# Altium project BtPS-250.PrjPcb
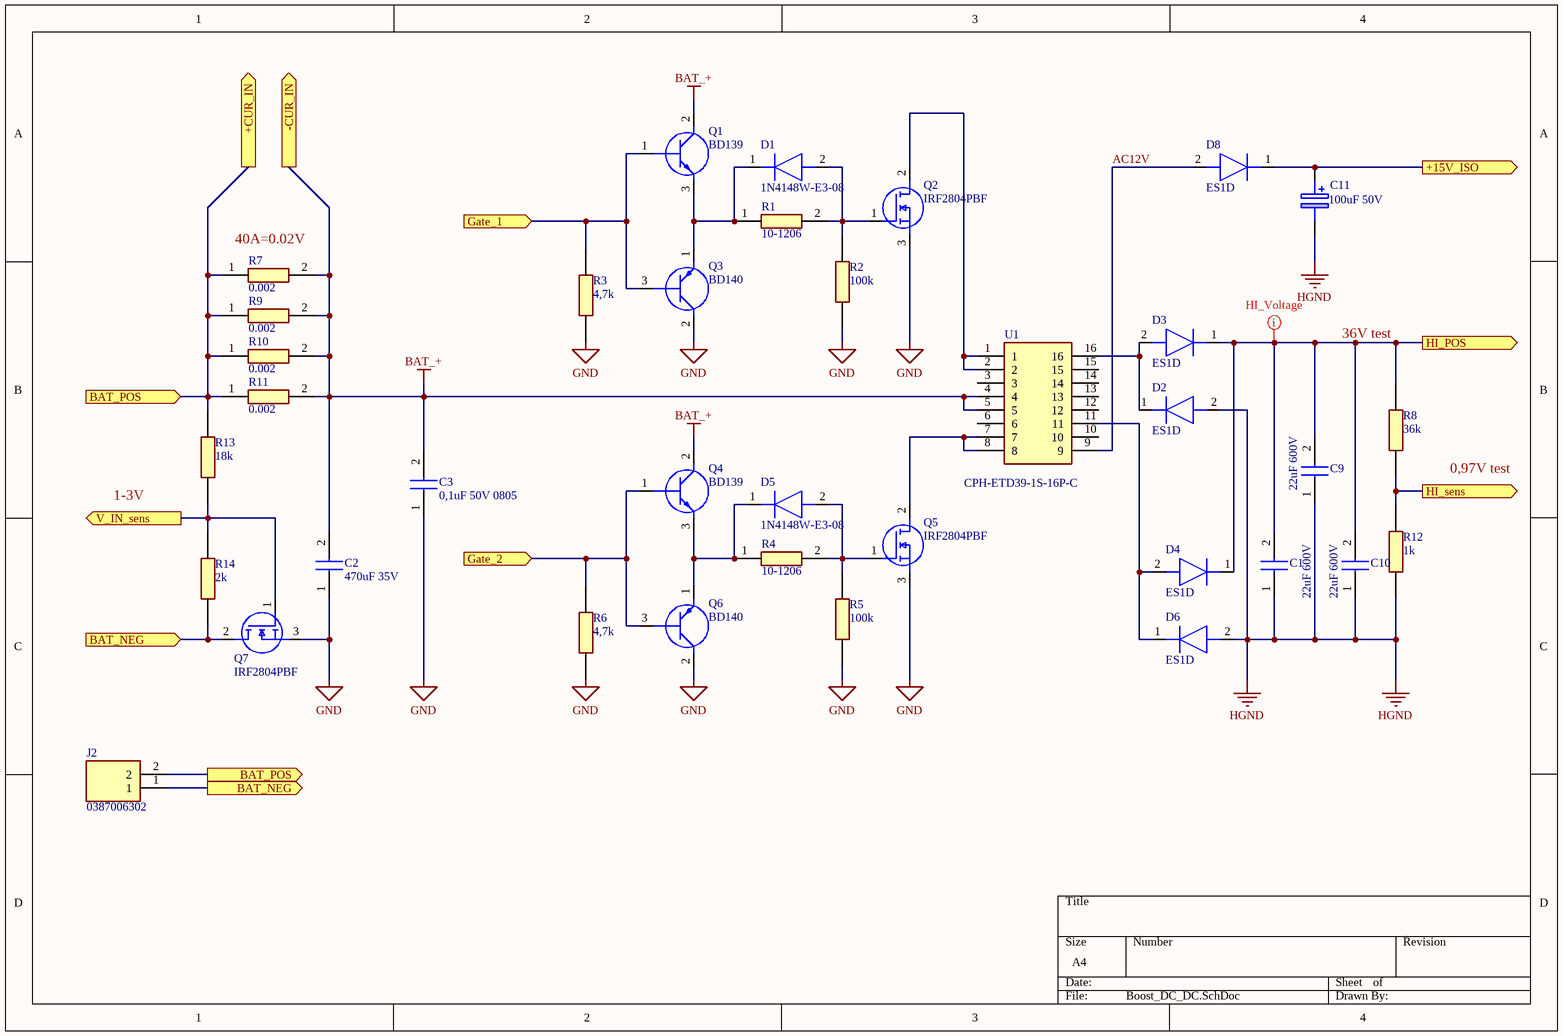
[diagram p0: Boost_DC_DC.SchDoc]
7 sheets, 145 parts. Net scope: flat (ports and power ports of the same name join across sheets).
Board file: BtPS-250.PcbDoc
Sheets:
  Boost_DC_DC.SchDoc
  Boost_Driver.SchDoc
  PWM_inverter.SchDoc
  PWM_Driver.SchDoc
  MCU.SchDoc
  Power_suply.SchDoc
  Mesure.SchDoc

## Sheet Boost_DC_DC.SchDoc
size A4

### Parts
C1  22uF 600V  [CAPPRD750W80D1625H2700]
C2  470uF 35V  [CAPPRD750W80D1625H2700]
C3  0,1uF 50V 0805  [CAPC2012X90N]
C9  22uF 600V  [CAPPRD750W80D1625H2700]
C10  22uF 600V  [CAPPRD750W80D1625H2700]
C11  100uF 50V  [CAPPRD500W60D870H1200]
D1  1N4148W-E3-08  [SOD3716X135N]
D2  ES1D  [DIOM5226X295N]
D3  ES1D  [DIOM5226X295N]
D4  ES1D  [DIOM5226X295N]
D5  1N4148W-E3-08  [SOD3716X135N]
D6  ES1D  [DIOM5226X295N]
D8  ES1D  [DIOM5226X295N]
J2  0387006302  [0387006302]
Q1  BD139  [TO254P290X760X1320-3P]
Q2  IRF2804PBF  [TO254P482X1016X2192-3P]
Q3  BD140  [TO229P300X760X1364-3P]
Q4  BD139  [TO254P290X760X1320-3P]
Q5  IRF2804PBF  [TO254P482X1016X2192-3P]
Q6  BD140  [TO229P300X760X1364-3P]
Q7  IRF2804PBF  [TO254P482X1016X2192-3P]
R1  10-1206  [RESC3116X75N]
R2  100k  [RESC2013X65N]
R3  4,7k  [RESC2013X65N]
R4  10-1206  [RESC3116X75N]
R5  100k  [RESC2013X65N]
R6  4,7k  [RESC2013X65N]
R7  0.002  [RESC3116X75N]
R8  36k  [RESC2013X65N]
R9  0.002  [RESC3116X75N]
R10  0.002  [RESC3116X75N]
R11  0.002  [RESC3116X75N]
R12  1k  [RESC2013X65N]
R13  18k  [RESC2013X65N]
R14  2k  [RESC2013X65N]
U1  CPH-ETD39-1S-16P-C  [DIPS3048W80P508L4460H3610Q16N]

### Ports
+15V_ISO (out), +CUR_IN (out), -CUR_IN (out), BAT_NEG (in), BAT_NEG (out), BAT_POS (in), BAT_POS (out), Gate_1 (in), Gate_2 (in), HI_POS (out), HI_sens (out), V_IN_sens (out)

### Nets
BAT_+: C2.2(-) C3.2 Q1.2(C) Q4.2(C) R7.2 R9.2 R10.2 R11.2 U1.4 U1.5 ; port -CUR_IN
GND: C2.1(+) C3.1 Q2.3(S) Q3.2(C) Q5.3(S) Q6.2(C) Q7.3(S) R2.1 R3.1 R5.1 R6.1
HGND: C1.1(+) C9.1(+) C10.1(+) C11.2(-) D2.2(A) D6.2(A) R12.1
AC12V: D8.2(A) U1.9
NetB4_1: C11.1(+) D8.1(K) ; port +15V_ISO
NetC1_2: C1.2(-) C9.2(-) C10.2(-) D3.1(K) D4.1(K) R8.2 ; port HI_POS
NetD1_1: D1.1(K) Q1.3(E) Q3.1(E) R1.1
NetD1_2: D1.2(A) Q2.1(G) R1.2 R2.2
NetD2_1: D2.1(K) D3.2(A) U1.16
NetD4_2: D4.2(A) D6.1(K) U1.11
NetD5_1: D5.1(K) Q4.3(E) Q6.1(E) R4.1
NetD5_2: D5.2(A) Q5.1(G) R4.2 R5.2
NetIC1_9: Q4.1(B) Q6.3(B) R6.2 ; port Gate_2
NetIC1_10: Q1.1(B) Q3.3(B) R3.2 ; port Gate_1
NetIC2_3: J2.2 R7.1 R9.1 R10.1 R11.1 R13.2 ; port BAT_POS, port +CUR_IN
NetJ2_1: J2.1 Q7.2(D) R14.1 ; port BAT_NEG
NetQ2_2: Q2.2(D) U1.1 U1.2
NetQ5_2: Q5.2(D) U1.7 U1.8
NetQ7_1: Q7.1(G) R13.1 R14.2 ; port V_IN_sens
NetR8_1: R8.1 R12.2 ; port HI_sens

Not connected (* = marked no-connect by the designer): U1 3 6 10 12 13 14 15

### Layout directives
net class HI_Voltage: NetC1_2

### Notes on the sheet
- (near R7) 40A=0.02V
- 36V test
- 1-3V
- 0,97V test

### Library data of the parts
C1 C2 C9 C10 = UPW1H102MHD: Capacitor; Height: 27mm
C3 = MCMT21N470F250CT: Capacitor; Height: 0.9mm
C11 = MAL203690109E3: Aluminum Electrolytic Capacitors - Radial Leaded 100uF 50V 20% Radial; Manufacturer_Name: Vishay; Geometry.Height: 12mm; Datasheet Link: https://www.vishay.com/docs/28312/036rsp.pdf; Manufacturer_Part_Number: MAL203690109E3; Mouser Part Number: 594-2222-036-90109; Mouser Price/Stock: https://www.mouser.co.uk/ProductDetail/Vishay-BC-Components/MAL203690109E3?qs=4T%252B5yYZyZYdFWMOgqUZuiA%3D%3D; Arrow Part Number: MAL203690109E3; Arrow Price/Stock: https://www.arrow.com/en/products/mal203690109e3/vishay; Mouser Testing Part Number: *; Mouser Testing Price/Stock: *
D1 D5 = 1N4148W-E3-08: Diode; Manufacturer_Name: Vishay; Datasheet Link: http://www.vishay.com/docs/85748/1n4148w.pdf; Height: 1.35mm; Manufacturer_Part_Number: 1N4148W-E3-08; Mouser Part Number: 78-1N4148W-E3-08; Mouser Price/Stock: https://www.mouser.co.uk/ProductDetail/Vishay-Semiconductors/1N4148W-E3-08?qs=bTzheeSci6TVjpxfjjRVMw%3D%3D; Arrow Part Number: 1N4148W-E3-08; Arrow Price/Stock: https://www.arrow.com/en/products/1n4148w-e3-08/vishay?region=nac
D2-D4 D6 D8 = ES1D: Diode; Manufacturer_Name: SMC; Datasheet Link: https://4donline.ihs.com/images/VipMasterIC/IC/SMCD/SMCD-S-A0005425901/SMCD-S-A0005425901-1.pdf?hkey=833C7E3902CC3CD9C0453977398360A8; Height: 2.95mm; Manufacturer_Part_Number: ES1D
J2 = 0387006302: Connector; Manufacturer_Name: Molex; Datasheet Link: https://datasheet.datasheetarchive.com/originals/distributors/Datasheets-DGA23/1543392.pdf; Height: 13mm; Manufacturer_Part_Number: 0387006302; Mouser Part Number: N/A; Mouser Price/Stock: https://www.mouser.co.uk/ProductDetail/Molex/0387006302/?qs=PBcRNPEHKsoO9p6NPCT14g%3D%3D; Arrow Part Number: 0387006302; Arrow Price/Stock: https://www.arrow.com/en/products/0387006302/molex
Q1 Q4 = BD139: Transistor BJT NPN; Manufacturer_Name: STMicroelectronics; Datasheet Link: http://www.st.com/web/en/resource/technical/document/datasheet/CD00001225.pdf; Height: 2.9mm; Manufacturer_Part_Number: BD139; Mouser Part Number: 511-BD139; Mouser Price/Stock: https://www.mouser.co.uk/ProductDetail/STMicroelectronics/BD139?qs=ljbEvF4DwOPW%2FLxHSWYMMA%3D%3D; Arrow Part Number: BD139; Arrow Price/Stock: https://www.arrow.com/en/products/bd139/stmicroelectronics?region=europe
Q2 Q5 Q7 = IRF2804PBF: MOSFET (N-Channel); Manufacturer_Name: Infineon; Datasheet Link: https://componentsearchengine.com/Datasheets/1/IRF2804PBF.pdf; Height: 4.82mm; Manufacturer_Part_Number: IRF2804PBF; Mouser Part Number: 942-IRF2804PBF; Mouser Price/Stock: https://www.mouser.co.uk/ProductDetail/Infineon-IR/IRF2804PBF?qs=2r01AXMCG3OqtrI77lWLsA%3D%3D; Arrow Part Number: IRF2804PBF; Arrow Price/Stock: https://www.arrow.com/en/products/irf2804pbf/infineon-technologies-ag
Q3 Q6 = BD138: Transistor BJT PNP; Manufacturer_Name: onsemi; Datasheet Link: http://www.onsemi.com/pub/Collateral/BD136-D.PDF; Height: 3mm; Manufacturer_Part_Number: BD138; Mouser Part Number: 863-BD138; Mouser Price/Stock: https://www.mouser.co.uk/ProductDetail/onsemi/BD138?qs=vNc2DXHODiJSpBHA4I4SSg%3D%3D
R1 R4 R7 R9-R11 = MCMR12X1003FTL: Resistor; Height: 0.75mm
R2 R3 R5 R6 R8 R12-R14 = ERJP06J822V: Resistor; Height: 0.7mm
U1 = CPH-ETD39-1S-16P-C: Undefined or Miscellaneous; Manufacturer_Name: FERROXCUBE; Datasheet Link: http://www.farnell.com/datasheets/1935353.pdf; Height: 36.1mm; Manufacturer_Part_Number: CPH-ETD39-1S-16P-C

## Sheet Boost_Driver.SchDoc
size A4
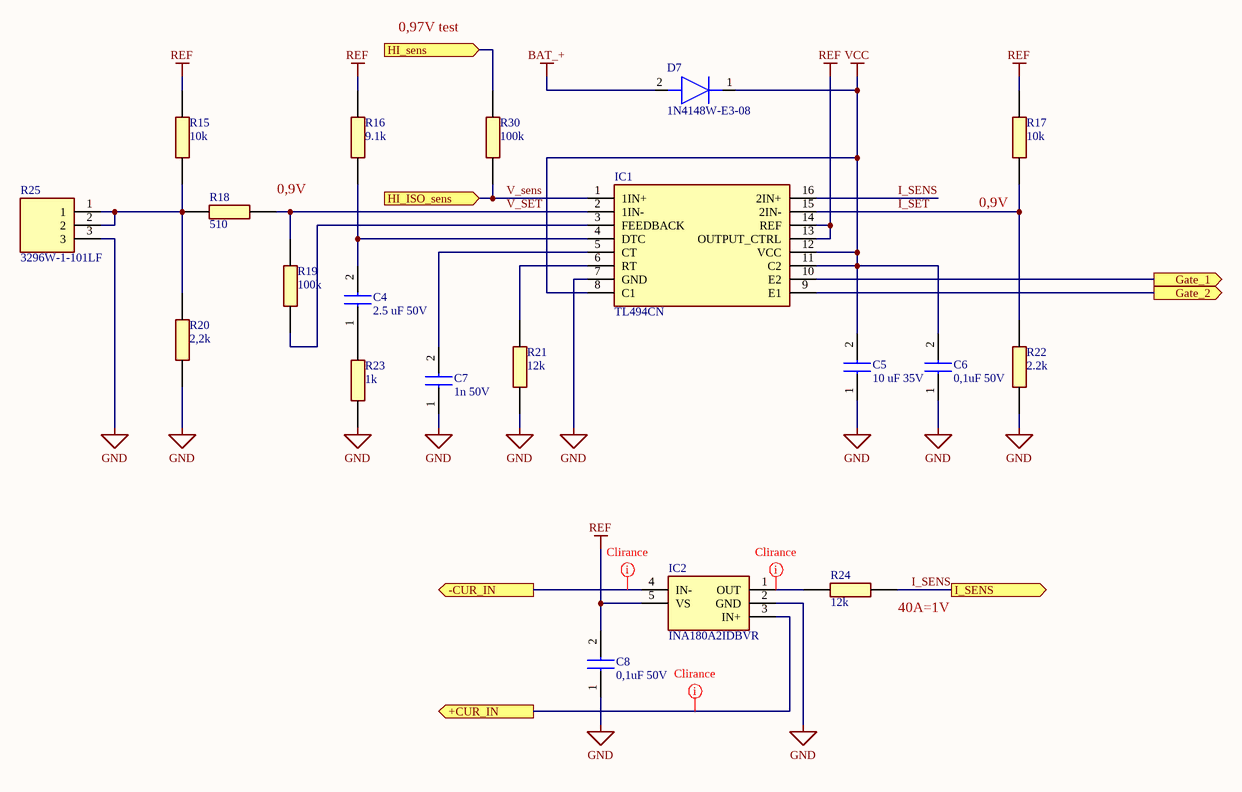
[diagram p1: Boost_Driver.SchDoc]

### Parts
C4  2.5 uF 50V  [CAPC2012X90N]
C5  10 uF 35V  [CAPC2012X90N]
C6  0,1uF 50V  [CAPC2012X90N]
C7  1n 50V  [CAPC2012X90N]
C8  0,1uF 50V  [CAPC2012X90N]
D7  1N4148W-E3-08  [SOD3716X135N]
IC1  TL494CN  [DIP794W53P254L1930H508Q16N]
IC2  INA180A2IDBVR  [SOT95P280X145-5N]
R15  10k  [RESC2013X65N]
R16  9.1k  [RESC2013X65N]
R17  10k  [RESC2013X65N]
R18  510  [RESC2013X65N]
R19  100k  [RESC2013X65N]
R20  2,2k  [RESC2013X65N]
R21  12k  [RESC2013X65N]
R22  2.2k  [RESC2013X65N]
R23  1k  [RESC2013X65N]
R24  12k  [RESC2013X65N]
R25  3296W-1-101LF  [3296W-1]
R30  100k  [RESC2013X65N]

### Ports
+CUR_IN (out), -CUR_IN (out), Gate_1 (out), Gate_2 (out), HI_ISO_sens (in), HI_sens (in), I_SENS (out)

### Nets
BAT_+: D7.2(A) IC2.4(IN-) ; port -CUR_IN
GND: C5.1 C6.1 C7.1 C8.1 IC1.7(GND) IC2.2(GND) R20.1 R21.1 R22.1 R23.1 R25.3
REF: C8.2 IC1.13(OUTPUT_CTRL) IC1.14(REF) IC2.5(VS) R15.2 R16.2 R17.2
VCC: C5.2 C6.2 D7.1(K) IC1.8(C1) IC1.11(C2) IC1.12(VCC)
I_SENS: IC1.16(2IN+) R24.1 ; port I_SENS
I_SET: IC1.15(2IN-) R17.1 R22.2
V_sens: IC1.1(1IN+) R30.2 ; port HI_ISO_sens
V_SET: IC1.2(1IN-) R18.1 R19.1
NetC4_1: C4.1 R23.2
NetC4_2: C4.2 IC1.4(DTC) R16.1
NetC7_2: C7.2 IC1.5(CT)
NetIC1_3: IC1.3(FEEDBACK) R19.2
NetIC1_6: IC1.6(RT) R21.2
NetIC1_9: IC1.9(E1) ; port Gate_2
NetIC1_10: IC1.10(E2) ; port Gate_1
NetIC2_1: IC2.1(OUT) R24.2
NetIC2_3: IC2.3(IN+) ; port +CUR_IN
NetR8_1: R30.1 ; port HI_sens
NetR15_1: R15.1 R18.2 R20.2 R25.1 R25.2

### Layout directives
net class LOW_Clirance: BAT_+, NetIC2_1, NetIC2_3

### Notes on the sheet
- 0,97V test
- (near R18) 0,9V
- (near R17) 0,9V
- (near R24) 40A=1V

### Library data of the parts
C4-C8 = MCMT21N470F250CT: Capacitor; Height: 0.9mm
D7 = 1N4148W-E3-08: Diode; Manufacturer_Name: Vishay; Datasheet Link: http://www.vishay.com/docs/85748/1n4148w.pdf; Height: 1.35mm; Manufacturer_Part_Number: 1N4148W-E3-08; Mouser Part Number: 78-1N4148W-E3-08; Mouser Price/Stock: https://www.mouser.co.uk/ProductDetail/Vishay-Semiconductors/1N4148W-E3-08?qs=bTzheeSci6TVjpxfjjRVMw%3D%3D; Arrow Part Number: 1N4148W-E3-08; Arrow Price/Stock: https://www.arrow.com/en/products/1n4148w-e3-08/vishay?region=nac
IC1 = TL494CN: Integrated Circuit; Manufacturer_Name: Texas Instruments; Datasheet Link: http://www.ti.com/lit/gpn/tl494; Height: 5.08mm; Manufacturer_Part_Number: TL494CN; Mouser Part Number: 595-TL494CN; Mouser Price/Stock: https://www.mouser.co.uk/ProductDetail/Texas-Instruments/TL494CN?qs=N6WZOzgtpqWAYQVxthNGyw%3D%3D; Arrow Part Number: TL494CN; Arrow Price/Stock: https://www.arrow.com/en/products/tl494cn/texas-instruments?region=nac
IC2 = INA180A2IDBVR: Integrated Circuit; Manufacturer_Name: Texas Instruments; Datasheet Link: http://www.ti.com/lit/ds/symlink/ina180.pdf; Height: 1.45mm; Manufacturer_Part_Number: INA180A2IDBVR; Mouser Part Number: 595-INA180A2IDBVR; Mouser Price/Stock: https://www.mouser.co.uk/ProductDetail/Texas-Instruments/INA180A2IDBVR?qs=5aG0NVq1C4wYcJfa99BoHg%3D%3D; Arrow Part Number: INA180A2IDBVR; Arrow Price/Stock: https://www.arrow.com/en/products/ina180a2idbvr/texas-instruments?region=nac
R15-R24 R30 = ERJP06J822V: Resistor; Height: 0.7mm
R25 = 3296W-1-101LF: Resistor; Manufacturer_Name: Bourns; Datasheet Link: https://www.bourns.com/pdfs/3296.pdf; Manufacturer_Part_Number: 3296W-1-101LF; Mouser Part Number: 652-3296W-1-101LF; Mouser Price/Stock: https://www.mouser.co.uk/ProductDetail/Bourns/3296W-1-101LF?qs=UcU9LKO1dwEefwKxVJG4Jw%3D%3D; Arrow Part Number: 3296W-1-101LF; Arrow Price/Stock: https://www.arrow.com/en/products/3296w-1-101lf/bourns?region=europe

## Sheet PWM_inverter.SchDoc
size A4
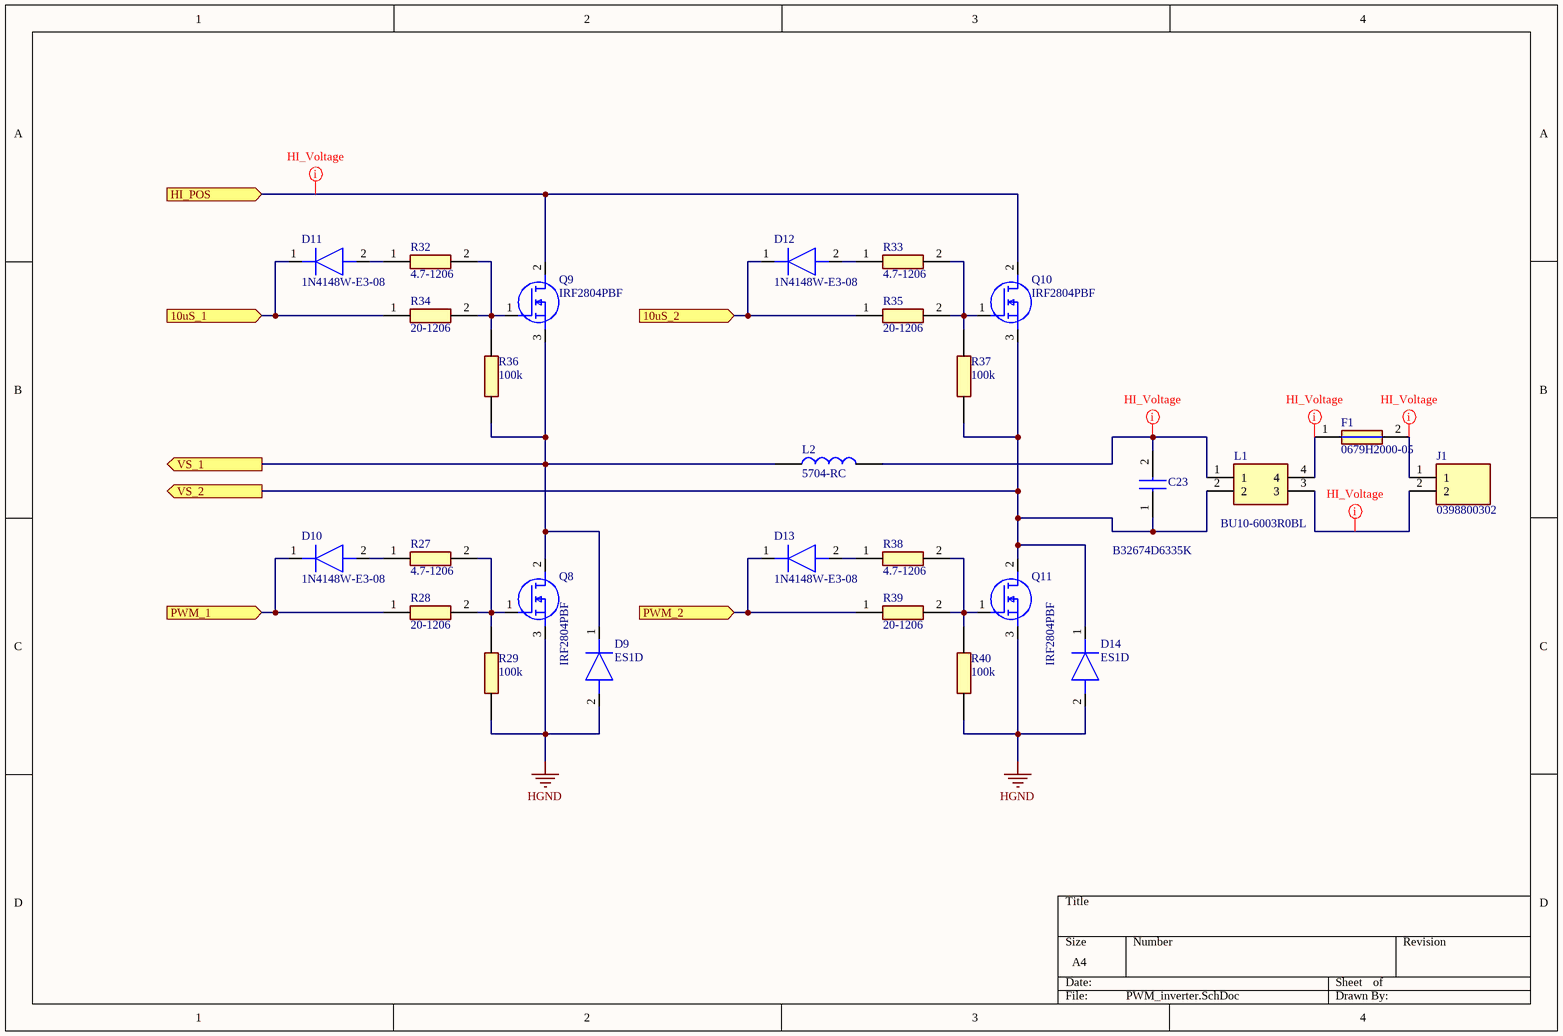
[diagram p2: PWM_inverter.SchDoc]

### Parts
C23  B32674D6335K  [B32674D6335K]
D9  ES1D  [DIOM5226X295N]
D10  1N4148W-E3-08  [SOD3716X135N]
D11  1N4148W-E3-08  [SOD3716X135N]
D12  1N4148W-E3-08  [SOD3716X135N]
D13  1N4148W-E3-08  [SOD3716X135N]
D14  ES1D  [DIOM5226X295N]
F1  0679H2000-05  [FUSC6125X279N]
J1  0398800302  [0398800302]
L1  BU10-6003R0BL  [BU106003R0BL]
L2  5704-RC  [5704RC]
Q8  IRF2804PBF  [TO254P482X1016X2192-3P]
Q9  IRF2804PBF  [TO254P482X1016X2192-3P]
Q10  IRF2804PBF  [TO254P482X1016X2192-3P]
Q11  IRF2804PBF  [TO254P482X1016X2192-3P]
R27  4.7-1206  [RESC3116X75N]
R28  20-1206  [RESC3116X75N]
R29  100k  [RESC2013X65N]
R32  4.7-1206  [RESC3116X75N]
R33  4.7-1206  [RESC3116X75N]
R34  20-1206  [RESC3116X75N]
R35  20-1206  [RESC3116X75N]
R36  100k  [RESC2013X65N]
R37  100k  [RESC2013X65N]
R38  4.7-1206  [RESC3116X75N]
R39  20-1206  [RESC3116X75N]
R40  100k  [RESC2013X65N]

### Ports
10uS_1 (in), 10uS_2 (in), HI_POS (in), PWM_1 (in), PWM_2 (in), VS_1 (out), VS_2 (out)

### Nets
HGND: D9.2(A) D14.2(A) Q8.3(S) Q11.3(S) R29.1 R40.1
NetC1_2: Q9.2(D) Q10.2(D) ; port HI_POS
NetC12_1: D9.1(K) L2.1 Q8.2(D) Q9.3(S) R36.1 ; port VS_1
NetC23_1: C23.1 D14.1(K) L1.2 Q10.3(S) Q11.2(D) R37.1 ; port VS_2
NetC23_2: C23.2 L1.1 L2.2
NetD10_1: D10.1(K) R28.1 ; port PWM_1
NetD10_2: D10.2(A) R27.1
NetD11_1: D11.1(K) R34.1 ; port 10uS_1
NetD11_2: D11.2(A) R32.1
NetD12_1: D12.1(K) R35.1 ; port 10uS_2
NetD12_2: D12.2(A) R33.1
NetD13_1: D13.1(K) R39.1 ; port PWM_2
NetD13_2: D13.2(A) R38.1
NetF1_1: F1.1 L1.4
NetF1_2: F1.2 J1.1
NetJ1_2: J1.2 L1.3
NetQ8_1: Q8.1(G) R27.2 R28.2 R29.2
NetQ9_1: Q9.1(G) R32.2 R34.2 R36.2
NetQ10_1: Q10.1(G) R33.2 R35.2 R37.2
NetQ11_1: Q11.1(G) R38.2 R39.2 R40.2

### Layout directives
net class HI_Voltage: NetC1_2, NetC23_2, NetF1_1, NetF1_2, NetJ1_2

### Library data of the parts
C23 = B32674D6335K: Capacitor; Manufacturer_Name: TDK; Datasheet Link: https://en.tdk.eu/inf/20/20/db/fc_2009/MKP_B32674_678.pdf; Height: 32mm; Manufacturer_Part_Number: B32674D6335K; Mouser Part Number: 871-B32674D6335K; Mouser Price/Stock: https://www.mouser.co.uk/ProductDetail/EPCOS-TDK/B32674D6335K?qs=IQR8xM2KsGjr5uKRT4Ngjw%3D%3D; Arrow Part Number: B32674D6335K; Arrow Price/Stock: https://www.arrow.com/en/products/b32674d6335k/epcos-tdk
D9 D14 = ES1D: Diode; Manufacturer_Name: SMC; Datasheet Link: https://4donline.ihs.com/images/VipMasterIC/IC/SMCD/SMCD-S-A0005425901/SMCD-S-A0005425901-1.pdf?hkey=833C7E3902CC3CD9C0453977398360A8; Height: 2.95mm; Manufacturer_Part_Number: ES1D
D10-D13 = 1N4148W-E3-08: Diode; Manufacturer_Name: Vishay; Datasheet Link: http://www.vishay.com/docs/85748/1n4148w.pdf; Height: 1.35mm; Manufacturer_Part_Number: 1N4148W-E3-08; Mouser Part Number: 78-1N4148W-E3-08; Mouser Price/Stock: https://www.mouser.co.uk/ProductDetail/Vishay-Semiconductors/1N4148W-E3-08?qs=bTzheeSci6TVjpxfjjRVMw%3D%3D; Arrow Part Number: 1N4148W-E3-08; Arrow Price/Stock: https://www.arrow.com/en/products/1n4148w-e3-08/vishay?region=nac
F1 = 0679H2000-05: Fuse; Manufacturer_Name: Bel Circuit Protection; Datasheet Link: https://www.arrow.com/en/products/0679h2000-05/bel-group; Height: 2.79mm; Manufacturer_Part_Number: 0679H2000-05; Arrow Part Number: 0679H2000-05; Arrow Price/Stock: https://www.arrow.com/en/products/0679h2000-05/bel-group?region=nac
J1 = 0398800302: Connector; Manufacturer_Name: Molex; Datasheet Link: https://www.molex.com/pdm_docs/sd/398800302_sd.pdf; Height: 10.3mm; Manufacturer_Part_Number: 0398800302; Mouser Part Number: N/A; Mouser Price/Stock: https://www.mouser.co.uk/ProductDetail/Molex/0398800302?qs=PBcRNPEHKsqSgs7Dx0mONg%3D%3D; Arrow Part Number: 0398800302; Arrow Price/Stock: https://www.arrow.com/en/products/0398800302/molex?region=nac
L1 = BU10-6003R0BL: Inductor; Manufacturer_Name: COILCRAFT; Datasheet Link: https://componentsearchengine.com/Datasheets/1/BU10-6003R0BL.pdf; Height: 22.5mm; Manufacturer_Part_Number: BU10-6003R0BL; Mouser Part Number: 994-BU10-6003R0BL; Mouser Price/Stock: https://www.mouser.co.uk/ProductDetail/Coilcraft/BU10-6003R0BL?qs=ZYnrCdKdyec0p%252B8vTszPQw%3D%3D
L2 = 5704-RC: Inductor High Current Toroid 275uH/150uH 15% 1KHz 2A 0.24Ohm DCR RDL; Manufacturer_Name: Bourns; Geometry.Height: 22.225mm; Manufacturer_Part_Number: 5704-RC; Mouser Part Number: 542-5704-RC; Mouser Price/Stock: https://www.mouser.co.uk/ProductDetail/JW-Miller/5704-RC?qs=bN78%2FnoHSDjVEliEAq9T7g%3D%3D; Arrow Part Number: *; Arrow Price/Stock: *; Mouser Testing Part Number: *; Mouser Testing Price/Stock: *; Datasheet Link: https://www.bourns.com/docs/Product-Datasheets/5700_series.pdf
Q8-Q11 = IRF2804PBF: as Q2 on sheet Boost_DC_DC; Datasheet Link: https://componentsearchengine.com/Datasheets/1/IRF2804PBF.pdf; Height: 4.82mm; Manufacturer_Part_Number: IRF2804PBF; Mouser Part Number: 942-IRF2804PBF; Mouser Price/Stock: https://www.mouser.co.uk/ProductDetail/Infineon-IR/IRF2804PBF?qs=2r01AXMCG3OqtrI77lWLsA%3D%3D; Arrow Part Number: IRF2804PBF; Arrow Price/Stock: https://www.arrow.com/en/products/irf2804pbf/infineon-technologies-ag
R27 R28 R32-R35 R38 R39 = MCMR12X1003FTL: Resistor; Height: 0.75mm
R29 R36 R37 R40 = ERJP06J822V: Resistor; Height: 0.7mm

## Sheet PWM_Driver.SchDoc
size A4
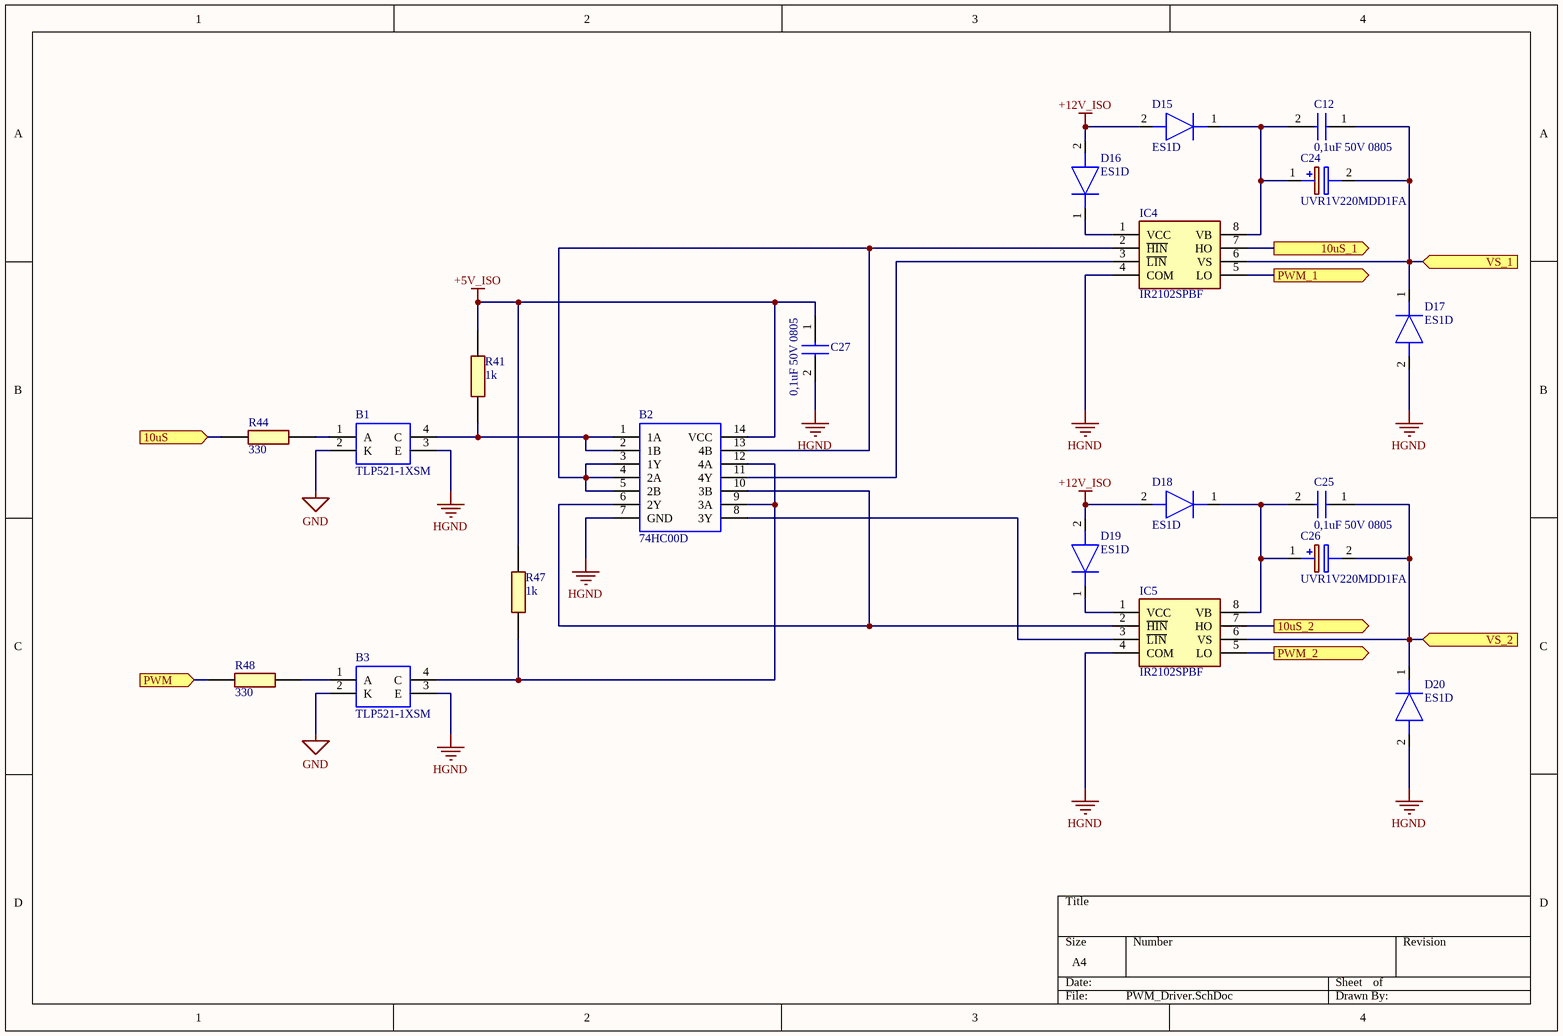
[diagram p3: PWM_Driver.SchDoc]

### Parts
B1  TLP521-1XSM  [SOP254P1016X460-4N]
B2  74HC00D  [SOIC127P600X175-14N]
B3  TLP521-1XSM  [SOP254P1016X460-4N]
C12  0,1uF 50V 0805  [CAPC2012X90N]
C24  UVR1V220MDD1FA  [CAPPRD200W50D525H1250]
C25  0,1uF 50V 0805  [CAPC2012X90N]
C26  UVR1V220MDD1FA  [CAPPRD200W50D525H1250]
C27  0,1uF 50V 0805  [CAPC2012X90N]
D15  ES1D  [DIOM5226X295N]
D16  ES1D  [DIOM5226X295N]
D17  ES1D  [DIOM5226X295N]
D18  ES1D  [DIOM5226X295N]
D19  ES1D  [DIOM5226X295N]
D20  ES1D  [DIOM5226X295N]
IC4  IR2102SPBF  [SOIC127P600X175-8N]
IC5  IR2102SPBF  [SOIC127P600X175-8N]
R41  1k  [RESC2013X65N]
R44  330  [RESC2013X65N]
R47  1k  [RESC2013X65N]
R48  330  [RESC2013X65N]

### Ports
10uS (in), 10uS_1 (out), 10uS_2 (out), PWM (in), PWM_1 (out), PWM_2 (out), VS_1 (in), VS_2 (in)

### Nets
+5V_ISO: B2.14(VCC) C27.1 R41.1 R47.1
+12V_ISO: D15.2(A) D16.2(A) D18.2(A) D19.2(A)
GND: B1.2(K) B3.2(K)
HGND: B1.3(E) B2.7(GND) B3.3(E) C27.2 D17.2(A) D20.2(A) IC4.4(COM) IC5.4(COM)
NetB1_1: B1.1(A) R44.2
NetB1_4: B1.4(C) B2.1(1A) B2.2(1B) R41.2
NetB2_3: B2.3(1Y) B2.4(2A) B2.5(2B) B2.13(4B) IC4.2(~{HIN})
NetB2_6: B2.6(2Y) B2.10(3B) IC5.2(~{HIN})
NetB2_8: B2.8(3Y) IC5.3(~{LIN})
NetB2_9: B2.9(3A) B2.12(4A) B3.4(C) R47.2
NetB2_11: B2.11(4Y) IC4.3(~{LIN})
NetB3_1: B3.1(A) R48.2
NetC12_1: C12.1 C24.2(-) D17.1(K) IC4.6(VS) ; port VS_1
NetC12_2: C12.2 C24.1(+) D15.1(K) IC4.8(VB)
NetC23_1: C25.1 C26.2(-) D20.1(K) IC5.6(VS) ; port VS_2
NetC25_2: C25.2 C26.1(+) D18.1(K) IC5.8(VB)
NetD10_1: IC4.5(LO) ; port PWM_1
NetD11_1: IC4.7(HO) ; port 10uS_1
NetD12_1: IC5.7(HO) ; port 10uS_2
NetD13_1: IC5.5(LO) ; port PWM_2
NetD16_1: D16.1(K) IC4.1(VCC)
NetD19_1: D19.1(K) IC5.1(VCC)
NetR44_1: R44.1 ; port 10uS
NetR48_1: R48.1 ; port PWM

### Library data of the parts
B1 B3 = TLP521-1XSM: Optocoupler; SMD; Channels:1; Out: transistor; Uinsul:5.3kV; Manufacturer_Name: Isocom; Geometry.Height: 4.6mm; Manufacturer_Part_Number: TLP521-1XSM; Mouser Part Number: *; Mouser Price/Stock: *; Arrow Part Number: *; Arrow Price/Stock: *; Mouser Testing Part Number: *; Mouser Testing Price/Stock: *; Datasheet Link: https://datasheet.lcsc.com/szlcsc/Isocom-Components-TLP521-1XSM_C83157.pdf
B2 = 74HC00D: NEXPERIA - 74HC00D - NAND Gate, 74HC00, 2 Input, 5.2 mA, 2 V to 6 V, SOIC-14; Geometry.Height: 1.75mm; Manufacturer_Name: Nexperia; Manufacturer_Part_Number: 74HC00D; Mouser Part Number: 771-74HC00D; Mouser Price/Stock: https://www.mouser.co.uk/ProductDetail/Nexperia/74HC00D?qs=Q7xBXtx7xQgKEyQZmXe6mg%3D%3D; Arrow Part Number: *; Arrow Price/Stock: *; Mouser Testing Part Number: *; Mouser Testing Price/Stock: *; Datasheet Link: https://altium.componentsearchengine.com/Datasheets/2/74HC00D.pdf
C12 C25 C27 = MCMT21N470F250CT: Capacitor; Height: 0.9mm
C24 C26 = UVR1V220MDD1FA: Capacitor Polarised; Manufacturer_Name: Nichicon; Datasheet Link: https://componentsearchengine.com/Datasheets/1/UVR1V220MDD1FA.pdf; Height: 12.5mm; Manufacturer_Part_Number: UVR1V220MDD1FA; Mouser Part Number: 647-UVR1V220MDD1FA; Mouser Price/Stock: https://www.mouser.co.uk/ProductDetail/Nichicon/UVR1V220MDD1FA/?qs=aEaV1LakhLZp9mEQuSYOqQ%3D%3D
D15-D20 = ES1D: Diode; Manufacturer_Name: SMC; Datasheet Link: https://4donline.ihs.com/images/VipMasterIC/IC/SMCD/SMCD-S-A0005425901/SMCD-S-A0005425901-1.pdf?hkey=833C7E3902CC3CD9C0453977398360A8; Height: 2.95mm; Manufacturer_Part_Number: ES1D
IC4 IC5 = IR2102SPBF: Integrated Circuit; Manufacturer_Name: Infineon; Datasheet Link: https://www.infineon.com/cms/en/product/power/gate-driver-ics/?; Height: 1.75mm; Manufacturer_Part_Number: IR2102SPBF; Mouser Part Number: 942-IR2102SPBF; Mouser Price/Stock: https://www.mouser.co.uk/ProductDetail/Infineon-IR/IR2102SPBF?qs=dQmlx5f5cRJqfCRMLAcrGg%3D%3D; Arrow Part Number: IR2102SPBF; Arrow Price/Stock: https://www.arrow.com/en/products/ir2102spbf/infineon-technologies-ag?region=nac
R41 R44 R47 R48 = ERJP06J822V: Resistor; Height: 0.7mm

## Sheet MCU.SchDoc
size A4
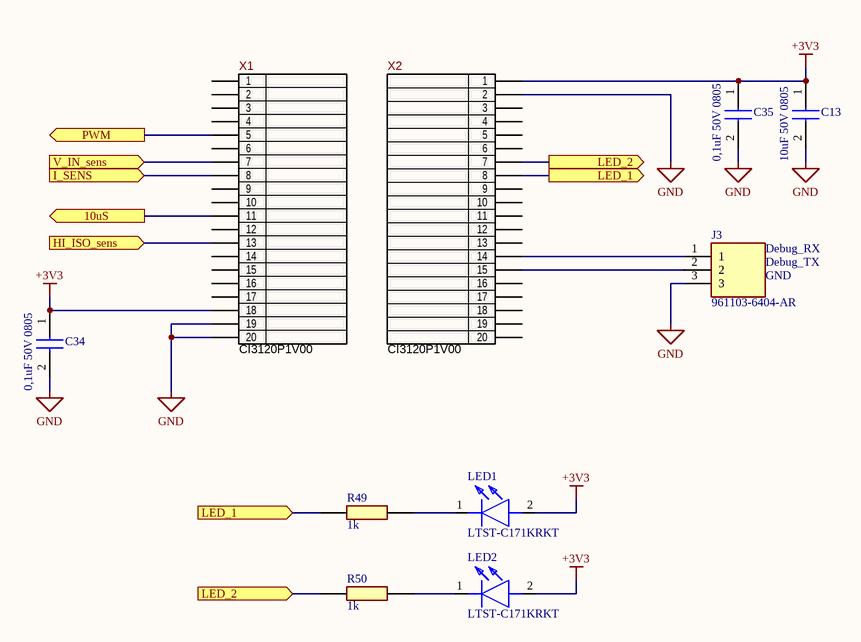
[diagram p4: MCU.SchDoc]

### Parts
C13  10uF 50V 0805  [CAPC2012X90N]
C34  0,1uF 50V 0805  [CAPC2012X90N]
C35  0,1uF 50V 0805  [CAPC2012X90N]
J3  961103-6404-AR  [HDRV3W64P0X254_1X3_762X250X1050P]
LED1  LTST-C171KRKT  [LEDM2012X90N]
LED2  LTST-C171KRKT  [LEDM2012X90N]
R49  1k  [RESC2013X65N]
R50  1k  [RESC2013X65N]
X1  Part Number: CI3120P1V00  [WF-20S]  (hidden comment: WH-20S)
X2  Part Number: CI3120P1V00  [WF-20S]  (hidden comment: WH-20S)

### Ports
10uS (out), HI_ISO_sens (in), I_SENS (in), LED_1 (in), LED_1 (out), LED_2 (in), LED_2 (out), PWM (out), V_IN_sens (in)

### Nets
+3V3: C13.1 C34.1 C35.1 LED1.2(A) LED2.2(A) X1.18 X2.1
GND: C13.2 C34.2 C35.2 J3.3 X1.19 X1.20 X2.2
I_SENS: X1.8 ; port I_SENS
V_sens: X1.13 ; port HI_ISO_sens
NetJ3_1: J3.1 X2.14
NetJ3_2: J3.2 X2.15
NetLED1_1: LED1.1(K) R49.1
NetLED2_1: LED2.1(K) R50.1
NetQ7_1: X1.7 ; port V_IN_sens
NetR44_1: X1.11 ; port 10uS
NetR48_1: X1.5 ; port PWM
NetR49_2: R49.2 X2.8 ; port LED_1
NetR50_2: R50.2 X2.7 ; port LED_2

Not connected (* = marked no-connect by the designer): X1 1 2 3 4 6 9 10 12 14 15 16 17; X2 3 4 5 6 9 10 11 12 13 16 17 18 19 20

### Notes on the sheet
- Debug_TX
- Debug_RX
- GND

### Library data of the parts
C13 C34 C35 = MCMT21N470F250CT: Capacitor; Height: 0.9mm
J3 = 961103-6404-AR: Connector; Manufacturer_Name: 3M; Datasheet Link: https://datasheet.datasheetarchive.com/originals/distributors/Datasheets-DGA21/2082015.pdf; Height: 10.5mm; Manufacturer_Part_Number: 961103-6404-AR; Mouser Part Number: 517-9611036404AR; Mouser Price/Stock: https://www.mouser.co.uk/ProductDetail/3M-Electronic-Solutions-Division/961103-6404-AR?qs=A%252BtsDZJT%252Bi8c%252BGQWaXFlLA%3D%3D
LED1 LED2 = LTST-C171KRKT: LED; Manufacturer_Name: Lite-On; Datasheet Link: http://www.mouser.com/datasheet/2/239/Lite-On-LTST-C171KRKT-1175280.pdf; Height: 0.9mm; Manufacturer_Part_Number: LTST-C171KRKT; Mouser Part Number: 859-LTST-C171KRKT; Mouser Price/Stock: https://www.mouser.co.uk/ProductDetail/Lite-On/LTST-C171KRKT?qs=5XMAZBf2SiSTcAb1f5vDzw%3D%3D; Arrow Part Number: LTST-C171KRKT; Arrow Price/Stock: https://www.arrow.com/en/products/ltst-c171krkt/lite-on-technology?region=nac
R49 R50 = ERJP06J822V: Resistor; Height: 0.7mm
X1 X2 = CI3120P1V00: WH Series 2.54mm Wire to Board Straight DIP Type Headers, 20 Pin; Manufacturer: CviLux; Ajax_1C_PN: NONE; Ajax_1С_Status: RND Only; Part Type: Wire-to-Board / Header; Component Type: PTH; Temperature Range: -25℃ ~ 85℃; ComponentLink1URL: https://www.cvilux.com/uploads/drawings/100/723/CI3102S.pdf; Replacement: NONE; Price: NONE; ComponentLink1Description: Datasheet

## Sheet Power_suply.SchDoc
size A4
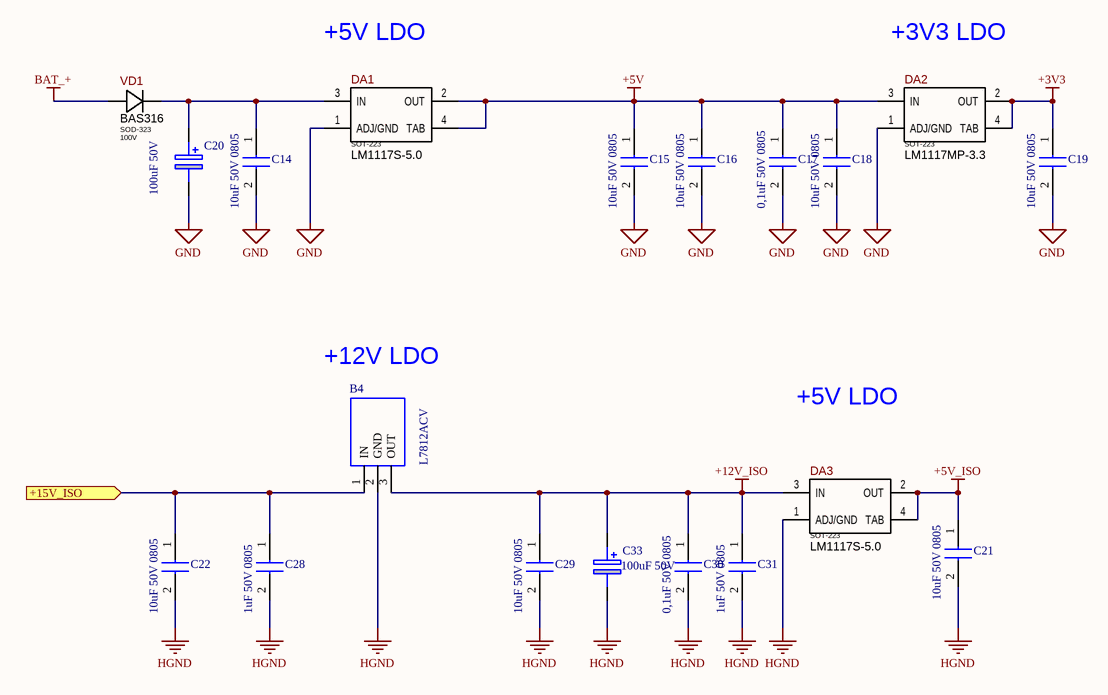
[diagram p5: Power_suply.SchDoc]

### Parts
B4  L7812ACV  [TO270P460X1020X2008-3P]
C14  10uF 50V 0805  [CAPC2012X90N]
C15  10uF 50V 0805  [CAPC2012X90N]
C16  10uF 50V 0805  [CAPC2012X90N]
C17  0,1uF 50V 0805  [CAPC2012X90N]
C18  10uF 50V 0805  [CAPC2012X90N]
C19  10uF 50V 0805  [CAPC2012X90N]
C20  100uF 50V  [CAPPRD500W60D870H1200]
C21  10uF 50V 0805  [CAPC2012X90N]
C22  10uF 50V 0805  [CAPC2012X90N]
C28  1uF 50V 0805  [CAPC2012X90N]
C29  10uF 50V 0805  [CAPC2012X90N]
C30  0,1uF 50V 0805  [CAPC2012X90N]
C31  1uF 50V 0805  [CAPC2012X90N]
C33  100uF 50V  [CAPPRD500W60D870H1200]
DA1  Part Number: LM1117S-5.0  [SOT-223]
DA2  Part Number: LM1117MP-3.3  [SOT-223]
DA3  Part Number: LM1117S-5.0  [SOT-223]
VD1  Package: SOD-323  Voltage: 100V  [SOD-323_MED]  (hidden comment: BAS316)

### Ports
+15V_ISO (in)

### Nets
+3V3: C19.1 DA2.2(OUT) DA2.4(TAB)
+5V: C15.1 C16.1 C17.1 C18.1 DA1.2(OUT) DA1.4(TAB) DA2.3(IN)
+5V_ISO: C21.1 DA3.2(OUT) DA3.4(TAB)
+12V_ISO: B4.3(OUT) C29.1 C30.1 C31.1 C33.1(+) DA3.3(IN)
BAT_+: VD1.AN
GND: C14.2 C15.2 C16.2 C17.2 C18.2 C19.2 C20.2(-) DA1.1(ADJ/GND) DA2.1(ADJ/GND)
HGND: B4.2(GND) C21.2 C22.2 C28.2 C29.2 C30.2 C31.2 C33.2(-) DA3.1(ADJ/GND)
NetB4_1: B4.1(IN) C22.1 C28.1 ; port +15V_ISO
NetC14_1: C14.1 C20.1(+) DA1.3(IN) VD1.CA

### Notes on the sheet
- +5V LDO
- +3V3 LDO
- +12V LDO

### Library data of the parts
B4 = L7812ACV: TO220 voltage regulator,L7812ACV 12V 1A STMicroelectronics L7812ACV, Single Linear Voltage Regulator, 1A 12 V, 2%, 3-Pin TO-220; Geometry.Height: 4.6mm; Manufacturer_Name: STMicroelectronics; Manufacturer_Part_Number: L7812ACV; Mouser Part Number: 511-L7812ACV; Mouser Price/Stock: https://www.mouser.co.uk/ProductDetail/STMicroelectronics/L7812ACV?qs=bZskSr8d5Y9fWhq%2FyUrU3A%3D%3D; Arrow Part Number: L7812ACV; Arrow Price/Stock: https://www.arrow.com/en/products/l7812acv/stmicroelectronics?region=europe; Mouser Testing Part Number: *; Mouser Testing Price/Stock: *; Datasheet Link: http://www.st.com/web/en/resource/technical/document/datasheet/CD00000444.pdf
C14-C19 C21 C22 C28-C31 = MCMT21N470F250CT: Capacitor; Height: 0.9mm
C20 C33 = MAL203690109E3: as C11 on sheet Boost_DC_DC; Datasheet Link: https://www.vishay.com/docs/28312/036rsp.pdf; Manufacturer_Part_Number: MAL203690109E3; Mouser Part Number: 594-2222-036-90109; Mouser Price/Stock: https://www.mouser.co.uk/ProductDetail/Vishay-BC-Components/MAL203690109E3?qs=4T%252B5yYZyZYdFWMOgqUZuiA%3D%3D; Arrow Part Number: MAL203690109E3; Arrow Price/Stock: https://www.arrow.com/en/products/mal203690109e3/vishay; Mouser Testing Part Number: *; Mouser Testing Price/Stock: *
DA1 DA3 = LM1117MP-3.3: Linear Voltage Regulator IC 1 Output 800mA SOT-223; Package: SOT-223; Component Type: SMD; ComponentLink1URL: https://www.ti.com/lit/ds/symlink/lm1117.pdf; ComponentLink1Description: Datasheet
DA2 = LM1117MP-3.3: Linear Voltage Regulator IC 1 Output 800mA SOT-223; Manufacturer: Texas Instruments; Ajax_1C_ID: 9463; Ajax_1C_PN: LM1117MP-3.3 Molded SOT-223, 6.50 x 3.56 x 1.6mm Body, 4 Lead, 2.3mm Pitch MP04A_N	1SPX; Standard Lead Time: 6 Weeks; Component Status: On Review; Replacement: NONE; GUID_1C: e0b887c0-e6df-11e6-82a6-d8cb8a9acc66; Package: SOT-223; Part Type: Power / Linear Regulator; Component Type: SMD; Lifecycle: RND Only; Temperature Range: 0°C ~ 125°C; ComponentLink1URL: https://www.ti.com/lit/ds/symlink/lm1117.pdf; Supplier 1: Digi-Key; Supplier Part Number 1: LM1117MP-3.3/NOPBTR-ND; ComponentLink1Description: Datasheet
VD1 = BAS316: Diode Standard 100V 250mA, SOD-323/SC-76; Manufacturer: Nexperia USA Inc.; Ajax_1C_ID: 3460; Ajax_1C_PN: BAS316,115 100V 0.25A(DC) Nexperia diode SOD-323; Marking: A6; Standard Lead Time: 4 Weeks; Vf: 1.25V @ 150mA; Replacement: BAS316,115 BAS316,135; Ajax_1С_Status: Mass Production; Part Number: BAS316; Part Type: General; Component Type: SMD; Current: 250mA; Temperature Range: -65°C ~ 150°C; ComponentLink1URL: https://assets.nexperia.com/documents/data-sheet/BAS16_SER.pdf; Supplier 1: Digi-Key; Supplier Part Number 1: 1727-7370-2-ND; ComponentLink1Description: Datasheet; Price: 0,00753566

## Sheet Mesure.SchDoc
size A4
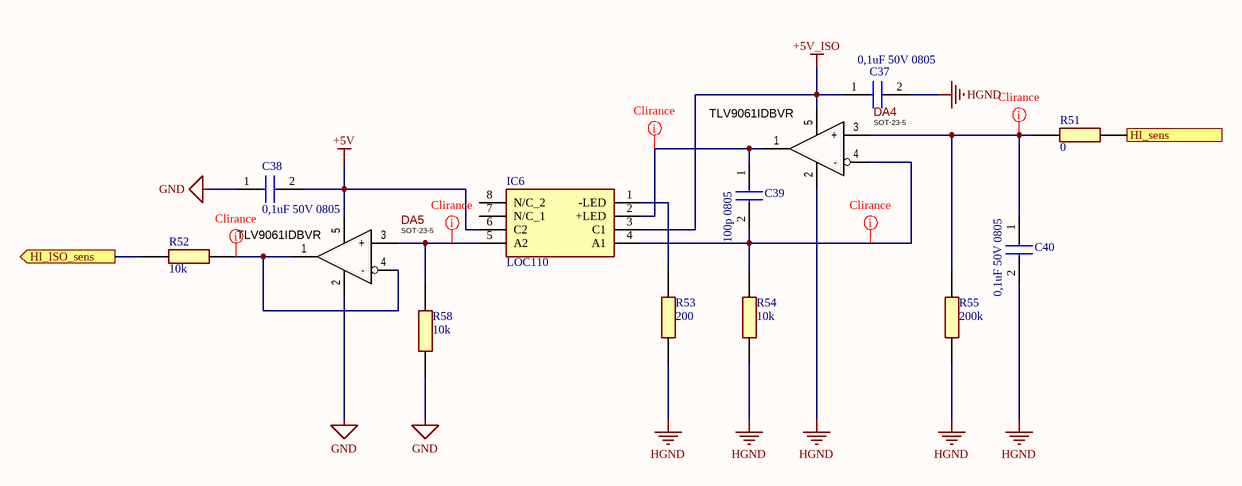
[diagram p6: Mesure.SchDoc]

### Parts
C37  0,1uF 50V 0805  [CAPC2012X90N]
C38  0,1uF 50V 0805  [CAPC2012X90N]
C39  100p 0805  [CAPC2012X90N]
C40  0,1uF 50V 0805  [CAPC2012X90N]
DA4  TLV9061IDBVR  [SOT-23-5]
DA5  TLV9061IDBVR  [SOT-23-5]
IC6  LOC110  [DIP762W53P254L965H335Q8N]
R51  0  [RESC2013X65N]
R52  10k  [RESC2013X65N]
R53  200  [RESC2013X65N]
R54  10k  [RESC2013X65N]
R55  200k  [RESC2013X65N]
R58  10k  [RESC2013X65N]

### Ports
HI_ISO_sens (out), HI_sens

### Nets
+5V: C38.2 DA5.5(V+) IC6.6(C2)
+5V_ISO: C37.1 DA4.5(V+) IC6.3(C1)
GND: C38.1 DA5.2(V-) R58.1
HGND: C37.2 C40.2 DA4.2(V-) R53.1 R54.1 R55.1
V_sens: R52.2 ; port HI_ISO_sens
NetC39_1: C39.1 DA4.1(OUT) IC6.2(+LED)
NetC39_2: C39.2 DA4.4(-) IC6.4(A1) R54.2
NetC40_1: C40.1 DA4.3(+) R51.2 R55.2
NetDA5_1: DA5.1(OUT) DA5.4(-) R52.1
NetDA5_3: DA5.3(+) IC6.5(A2) R58.2
NetIC6_1: IC6.1(-LED) R53.2
NetR8_1: R51.1 ; port HI_sens

Not connected (* = marked no-connect by the designer): IC6 7(N/C_1) 8(N/C_2)

### Layout directives
net class LOW_Clirance: NetC39_1, NetC39_2, NetC40_1, NetDA5_1, NetDA5_3

### Library data of the parts
C37-C40 = MCMT21N470F250CT: Capacitor; Height: 0.9mm
DA4 DA5 = TLV9061IDBVR: 10MHz, 0.5pA Bias, Rail-to-Rail Input/Output, 1.8V CMOS Operational Amplifiers, 1 Channels, SOT-23-5; Manufacturer: Texas Instruments; Ajax_1C_ID: 24284; Ajax_1C_PN: TLV9061IDBVR TI 1.8V-5.5V Operational Amplifier IC SOT23-5; Ajax_1С_Status: Mass Production; Standard Lead Time: 16 Weeks; Replacement: NONE; Package: SOT-23-5; Part Number: TLV9061IDBVR; Part Type: Amplifier / OpAmp; Component Type: SMD; Temperature Range: -40°C ~ 125°C; ComponentLink1URL: https://www.ti.com/lit/ds/symlink/tlv9061.pdf; Supplier 1: Digi-Key; Supplier Part Number 1: 296-52284-2-ND; Price: 0,72409091; ComponentLink1Description: Datasheet
IC6 = LOC110: Integrated Circuit; Manufacturer_Name: LITTELFUSE; Datasheet Link: http://www.ixysic.com/home/pdfs.nsf/0/2E7C7ED81A9497A385256A2C0068BE89/$file/LOC110.pdf; Height: 3.353mm; Manufacturer_Part_Number: LOC110; Mouser Part Number: 849-LOC110; Mouser Price/Stock: https://www.mouser.co.uk/ProductDetail/IXYS-Integrated-Circuits/LOC110?qs=lQlU%252BwB40guWe%2FeQ%2FzktPA%3D%3D; Arrow Part Number: LOC110; Arrow Price/Stock: https://www.arrow.com/en/products/loc110/ixys
R51-R55 R58 = ERJP06J822V: Resistor; Height: 0.7mm

## Nets that join several sheets
+3V3: MCU (7 pins), Power_suply (C19.1 DA2.2 DA2.4)
+5V: Power_suply (7 pins), Mesure (C38.2 DA5.5 IC6.6)
+5V_ISO: PWM_Driver (B2.14 C27.1 R41.1 R47.1), Power_suply (C21.1 DA3.2 DA3.4), Mesure (C37.1 DA4.5 IC6.3)
+12V_ISO: PWM_Driver (D15.2 D16.2 D18.2 D19.2), Power_suply (6 pins)
BAT_+: Boost_DC_DC (10 pins), Boost_Driver (D7.2 IC2.4), Power_suply (VD1.AN)
GND: Boost_DC_DC (11 pins), Boost_Driver (11 pins), PWM_Driver (B1.2 B3.2), MCU (7 pins), Power_suply (9 pins), Mesure (C38.1 DA5.2 R58.1)
HGND: Boost_DC_DC (7 pins), PWM_inverter (6 pins), PWM_Driver (8 pins), Power_suply (9 pins), Mesure (6 pins)
I_SENS: Boost_Driver (IC1.16 R24.1), MCU (X1.8)
NetB4_1: Boost_DC_DC (C11.1 D8.1), Power_suply (B4.1 C22.1 C28.1)
NetC1_2: Boost_DC_DC (6 pins), PWM_inverter (Q9.2 Q10.2)
NetC12_1: PWM_inverter (5 pins), PWM_Driver (C12.1 C24.2 D17.1 IC4.6)
NetC23_1: PWM_inverter (6 pins), PWM_Driver (C25.1 C26.2 D20.1 IC5.6)
NetD10_1: PWM_inverter (D10.1 R28.1), PWM_Driver (IC4.5)
NetD11_1: PWM_inverter (D11.1 R34.1), PWM_Driver (IC4.7)
NetD12_1: PWM_inverter (D12.1 R35.1), PWM_Driver (IC5.7)
NetD13_1: PWM_inverter (D13.1 R39.1), PWM_Driver (IC5.5)
NetIC1_9: Boost_DC_DC (Q4.1 Q6.3 R6.2), Boost_Driver (IC1.9)
NetIC1_10: Boost_DC_DC (Q1.1 Q3.3 R3.2), Boost_Driver (IC1.10)
NetIC2_3: Boost_DC_DC (6 pins), Boost_Driver (IC2.3)
NetQ7_1: Boost_DC_DC (Q7.1 R13.1 R14.2), MCU (X1.7)
NetR8_1: Boost_DC_DC (R8.1 R12.2), Boost_Driver (R30.1), Mesure (R51.1)
NetR44_1: PWM_Driver (R44.1), MCU (X1.11)
NetR48_1: PWM_Driver (R48.1), MCU (X1.5)
V_sens: Boost_Driver (IC1.1 R30.2), MCU (X1.13), Mesure (R52.2)